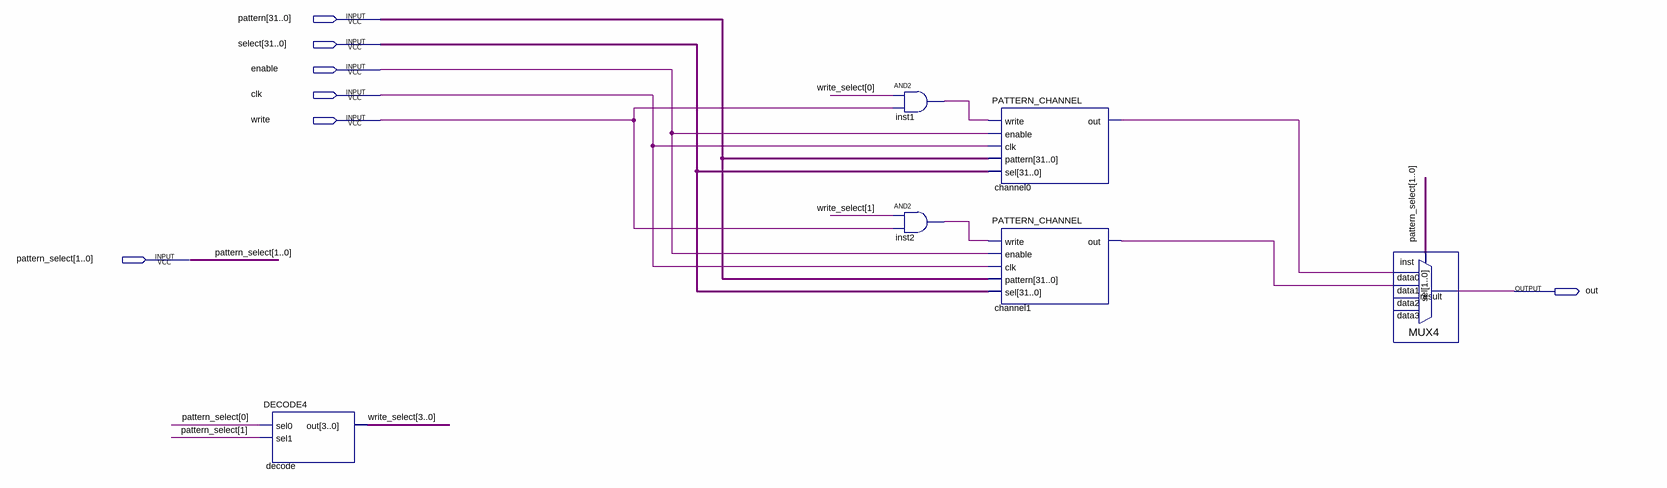
[diagram p0: schematic sheet]
// Quartus schematic CHANNEL2.bdf as structural Verilog: 6 symbols, 7 pins
module CHANNEL2 (
  input  [31:0] pattern,
  input  [31:0] select,
  input  enable,
  input  clk,
  input  write,
  input  [1:0] pattern_select,
  output out
);

  wire channel0_out, channel1_out, inst1_out, inst2_out;
  wire [3:0] write_select;

  DECODE4 decode (.sel0(pattern_select[0]), .sel1(pattern_select[1]), .out(write_select));
  and inst1 (inst1_out, write_select[0], write);
  and inst2 (inst2_out, write_select[1], write);
  PATTERN_CHANNEL channel0 (
    .write(inst1_out), .enable(enable), .clk(clk), .pattern(pattern), .sel(select), .out(channel0_out));
  PATTERN_CHANNEL channel1 (
    .write(inst2_out), .enable(enable), .clk(clk), .pattern(pattern), .sel(select), .out(channel1_out));
  MUX4 inst (.data1(channel1_out), .data0(channel0_out), .sel(pattern_select), .result(out));  // open: data3, data2
endmodule
